# EAGLE design cyclops_r2b (EAGLE 6.4)

## Sheet 1 of 3
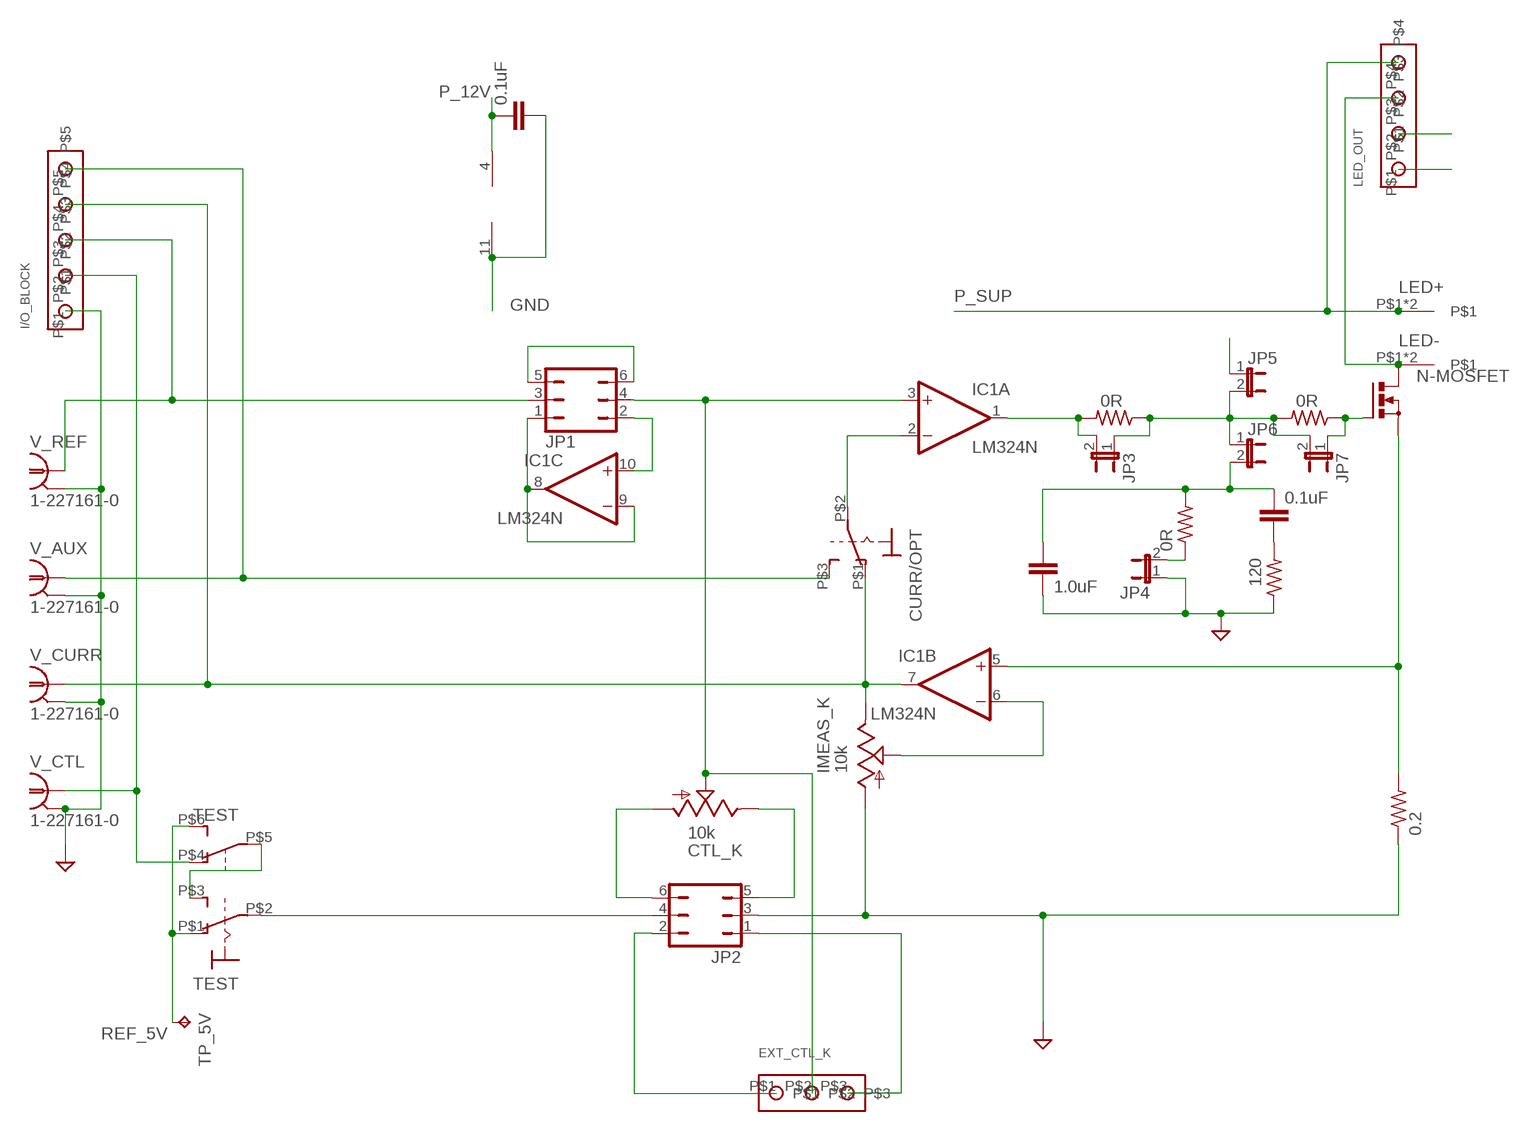
[diagram p0: schematic, sheet 1]

### Parts
C1  0.1uF  C-EU050-024X044  [C050-024X044]
C2  1.0uF  C-EU025-024X044  [C025-024X044]
C3  0.1uF  C-EU050-024X044  [C050-024X044]
CTL_K  10k  TRIM_US-RJ6S  [RJ6S]
CURR/OPT  SPST_SWITCH  [A_TOGGLE_SPST]
EXT_CTL_K  SCREW3  [SCREW3]
I/O_BLOCK  SCREW5  [SCREW5]
IC1  LM324N  [DIL14]
IMEAS_K  10k  TRIM_US-RJ6S  [RJ6S]
JP1  JP3Q  [JP3Q]
JP2  JP3Q  [JP3Q]
JP3  JP1E  [JP1]
JP4  JP1E  [JP1]
JP5  JP1E  [JP1]
JP6  JP1E  [JP1]
JP7  JP1E  [JP1]
LED+  BANANA_TO_BOARD  [BANANA_TO_BOARD]
LED-  BANANA_TO_BOARD  [BANANA_TO_BOARD]
LED_OUT  SCREW4  [SCREW4]
N-MOSFET  PMOSFET_NTO220BH  [TO220BH]
R1  0R  R-US_0207/7  [0207/7]
R2  0R  R-US_0207/7  [0207/7]
R3  120  R-US_0207/7  [0207/7]
R4  0R  R-US_0207/7  [0207/7]
R_CURR  0.2  R-US_  [IMEAS_R]
TEST  SP3T_SWITCH  [320-938]
TP_5V  TPPAD1-13  [P1-13]
V_AUX  1-227161-0  [AMP_227161]
V_CTL  1-227161-0  [AMP_227161]
V_CURR  1-227161-0  [AMP_227161]
V_REF  1-227161-0  [AMP_227161]

### Nets
GND: C1.2 C2.2 I/O_BLOCK.P$1 IC1.11(P:V-) IMEAS_K.A JP2.3 JP4.1 LED_OUT.P$1 R3.1 R_CURR.1 V_AUX.2(GND) V_CTL.2(GND) V_CURR.2(GND) V_REF.2(GND) ; also sheet 2,3
N$1: CURR/OPT.P$2(P) IC1.2(A:-IN)
N$2: IC1.5(B:+IN) N-MOSFET.S R_CURR.2
N$3: IC1.1(A:OUT) JP3.2 R1.2
N$4: CURR/OPT.P$1(O) I/O_BLOCK.P$4 IC1.7(B:OUT) IMEAS_K.E V_CURR.1
N$5: CURR/OPT.P$3(S) I/O_BLOCK.P$5 V_AUX.1
N$6: JP2.4 TEST.P$2(1:P)
N$7: CTL_K.E JP2.5
N$8: CTL_K.S EXT_CTL_K.P$2 IC1.3(A:+IN) JP1.4
N$9: IC1.8(C:OUT) IC1.9(C:-IN) JP1.1
N$10: I/O_BLOCK.P$2 TEST.P$4(B:O) V_CTL.1
N$11: C2.1 C3.1 JP6.2 R2.2
N$12: CTL_K.A JP2.6
N$13: C3.2 R3.2
N$14: IC1.10(C:+IN) JP1.2
N$15: IC1.6(B:-IN) IMEAS_K.S
N$17: JP1.5 JP1.6
N$18: I/O_BLOCK.P$3 JP1.3 V_REF.1
N$21: LED-.P$1 LED-.P$2 LED_OUT.P$3 N-MOSFET.D
N$23: TEST.P$3(1:S) TEST.P$5(B:P)
N$25: EXT_CTL_K.P$1 JP2.2
N$26: EXT_CTL_K.P$3 JP2.1
N$27: JP4.2 R2.1
N$29: JP3.1 JP5.2 JP6.1 JP7.2 R1.1 R4.2
N$30: JP7.1 N-MOSFET.G R4.1
N$69: JP5.1
P_12V: C1.1 IC1.4(P:V+) LED_OUT.P$2 ; also sheet 2
P_SUP: LED+.P$1 LED+.P$2 LED_OUT.P$4 ; also sheet 2,3
REF_5V: TEST.P$1(1:O) TEST.P$6(B:S) TP_5V.TP ; also sheet 2
Unconnected: IC1.12(D:+IN) IC1.13(D:-IN) IC1.14(D:OUT)

## Sheet 2 of 3
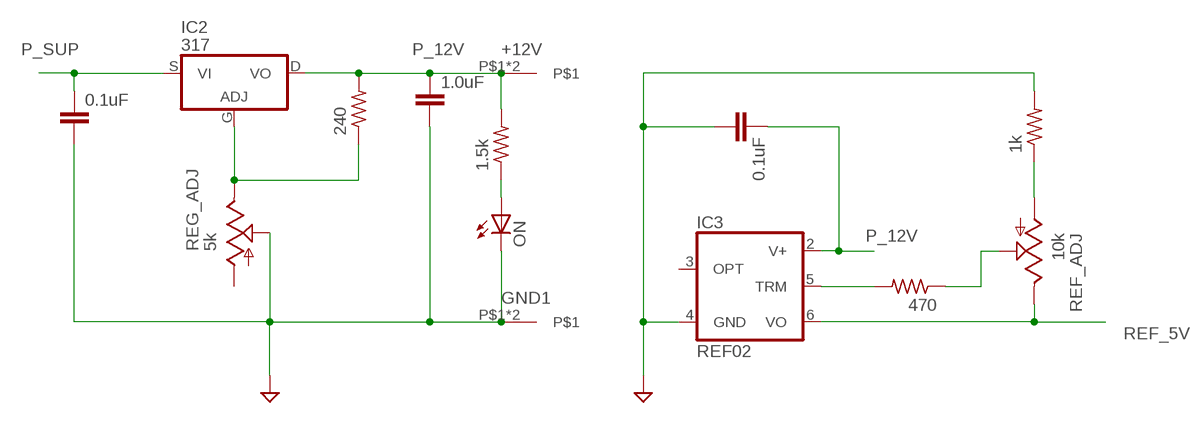
[diagram p1: schematic, sheet 2]

### Parts
+12V  BANANA_TO_BOARD  [BANANA_TO_BOARD]
C4  0.1uF  C-EU050-024X044  [C050-024X044]
C5  1.0uF  C-EU025-024X044  [C025-024X044]
C6  0.1uF  C-EU050-024X044  [C050-024X044]
GND1  BANANA_TO_BOARD  [BANANA_TO_BOARD]
IC2  317  [TO220BH]
IC3  REF02  REF02DIL08-LONG  [DIL08-OVAL]
ON  LED3MM  [LED3MM]
R5  240  R-US_0207/7  [0207/7]
R6  1.5k  R-US_0207/7  [0207/7]
R7  470  R-US_0207/7  [0207/7]
R8  1k  R-US_0207/7  [0207/7]
REF_ADJ  10k  TRIM_US-RJ6S  [RJ6S]
REG_ADJ  5k  TRIM_US-RJ6S  [RJ6S]

### Nets
GND: C4.2 C5.2 C6.2 GND1.P$1 GND1.P$2 IC3.4(GND) ON.K(C) R8.2 REG_ADJ.S ; also sheet 1,3
N$19: IC2.G(ADJ) R5.1 REG_ADJ.E
N$20: IC3.5(TRM) R7.2
N$22: R7.1 REF_ADJ.S
N$24: R8.1 REF_ADJ.A
N$28: ON.A R6.1
P_12V: +12V.P$1 +12V.P$2 C5.1 C6.1 IC2.D(VO) IC3.2(V+) R5.2 R6.2 ; also sheet 1
P_SUP: C4.1 IC2.S(VI) ; also sheet 1,3
REF_5V: IC3.6(VO) REF_ADJ.E ; also sheet 1
Unconnected: IC3.3(OPT) REG_ADJ.A

## Sheet 3 of 3
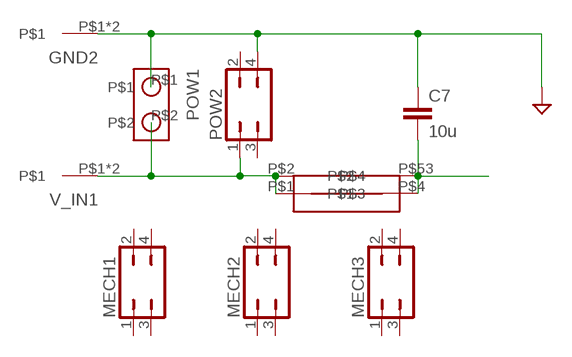
[diagram p2: schematic, sheet 3]

### Parts
C7  10u  C-EU025-024X044  [C025-024X044]
GND2  BANANA_TO_BOARD  [BANANA_TO_BOARD]
MECH1  JP2Q  [JP2Q]
MECH2  JP2Q  [JP2Q]
MECH3  JP2Q  [JP2Q]
POW1  SCREW2  [SCREW2]
POW2  JP2Q  [JP2Q]
U$1  FUSE >2A  NXT-FUSE  [NXT-FUSE]
V_IN1  BANANA_TO_BOARD  [BANANA_TO_BOARD]

### Nets
GND: C7.1 GND2.P$1 GND2.P$2 POW1.P$1 POW2.4 ; also sheet 1,2
P_SUP: C7.2 U$1.P$4 U$1.P$53 ; also sheet 1,2
P_SUP_BEFORE: POW1.P$2 POW2.1 U$1.P$1 U$1.P$2 V_IN1.P$1 V_IN1.P$2
Unconnected: MECH1.1 MECH1.2 MECH1.3 MECH1.4 MECH2.1 MECH2.2 MECH2.3 MECH2.4 MECH3.1 MECH3.2 MECH3.3 MECH3.4 POW2.2 POW2.3

## Library data of the parts
+12V GND1 GND2 LED+ LED- V_IN1 = cyclops:BANANA_TO_BOARD: Female banana socket to board, right angle. Digikey part: J111-ND (or similar).
C1-C7 = rcl:C-EU: CAPACITOR, European symbol
CTL_K IMEAS_K REF_ADJ REG_ADJ = HOSS:TRIM_US-: POTENTIOMETER
CURR/OPT = HOSS:SPST_SWITCH: TOGGLE SWITCH distributor RS Components
EXT_CTL_K = HOSS:SCREW3
I/O_BLOCK = HOSS:SCREW5
IC1 = linear:LM324: OP AMP
IC2 = HOSS:*317: Positive VOLTAGE REGULATOR
IC3 = linear:REF02: VOLTAGE REFERENCE
JP1 JP2 = jumper:JP3Q: JUMPER
JP3-JP7 = jumper:JP1E: JUMPER
LED_OUT = HOSS:SCREW4
MECH1-MECH3 POW2 = jumper:JP2Q: JUMPER
N-MOSFET = transistor-power:PMOSFET_N: Power MOSFET N-Channel
ON = led:LED: LED OSRAM: - CHIPLED LG R971, LG N971, LY N971, LG Q971, LY Q971, LO R971, LY R971 LH N974, LH R974 LS Q976, LO Q976, LY Q976 LO Q996 - Hyper CHIPLED LW Q18S LB Q993, LB Q99A, LB R99A - SideLED LS A670, LO A670, LY A670, LG A670, LP A670 LB A673, LV A673, LT A673, LW A673 LH A674 LY A675 LS A676, LA A676, LO A676, LY A676, LW A676 LS A679, LY A679, LG A679 - Hyper Micro SIDELED® LS Y876, LA Y876, LO Y876, LY Y876 LT Y87S - SmartLED LW L88C, LW L88S LB L89C, LB L89S, LG L890 LS L89K, LO L89K, LY L89K LS L896, LA L896, LO L896, LY L896 - TOPLED LS T670, LO T670, LY T670, LG T670, LP T670 LSG T670, LSP T670, LSY T670, LOP T670, LYG T670 LG T671, LOG T671, LSG T671 LB T673, LV T673, LT T673, LW T673 LH T674 LS T676, LA T676, LO T676, LY T676, LB T676, LH T676, LSB T676, LW T676 LB T67C, LV T67C, LT T67C, LS T67K, LO T67K, LY T67K, LW E67C LS E67B, LA E67B, LO E67B, LY E67B, LB E67C, LV E67C, LT E67C LW T67C LS T679, LY T679, LG T679 LS T770, LO T770, LY T770, LG T770, LP T770 LB T773, LV T773, LT T773, LW T773 LH T774 LS E675, LA E675, LY E675, LS T675 LS T776, LA T776, LO T776, LY T776, LB T776 LHGB T686 LT T68C, LB T68C - Hyper Mini TOPLED® LB M676 - Mini TOPLED Santana® LG M470 LS M47K, LO M47K, LY M47K Source: http://www.osram.convergy.de LUXEON: - LUMILED® LXK2-PW12-R00, LXK2-PW12-S00, LXK2-PW14-U00, LXK2-PW14-V00 LXK2-PM12-R00, LXK2-PM12-S00, LXK2-PM14-U00 LXK2-PE12-Q00, LXK2-PE12-R00, LXK2-PE12-S00, LXK2-PE14-T00, LXK2-PE14-U00 LXK2-PB12-K00, LXK2-PB12-L00, LXK2-PB12-M00, LXK2-PB14-N00, LXK2-PB14-P00, LXK2-PB14-Q00 LXK2-PR12-L00, LXK2-PR12-M00, LXK2-PR14-Q00, LXK2-PR14-R00 LXK2-PD12-Q00, LXK2-PD12-R00, LXK2-PD12-S00 LXK2-PH12-R00, LXK2-PH12-S00 LXK2-PL12-P00, LXK2-PL12-Q00, LXK2-PL12-R00 Source: www.luxeon.com KINGBRIGHT: KA-3528ASYC Source: www.kingbright.com
POW1 = HOSS:SCREW2
R1-R8 R_CURR = HOSS:R-US_: RESISTOR, American symbol
TEST = HOSS:SP3T_SWITCH: TOGGLE SWITCH distributor RS Components
TP_5V = testpad:TP: Test pad
U$1 = HOSS:NXT-FUSE
V_AUX V_CTL V_CURR V_REF = cyclops:?227161*: JACK, RIGHT ANGLE, 50 OHM, PCB, BNC Source: amp_227161.pdf

## Board
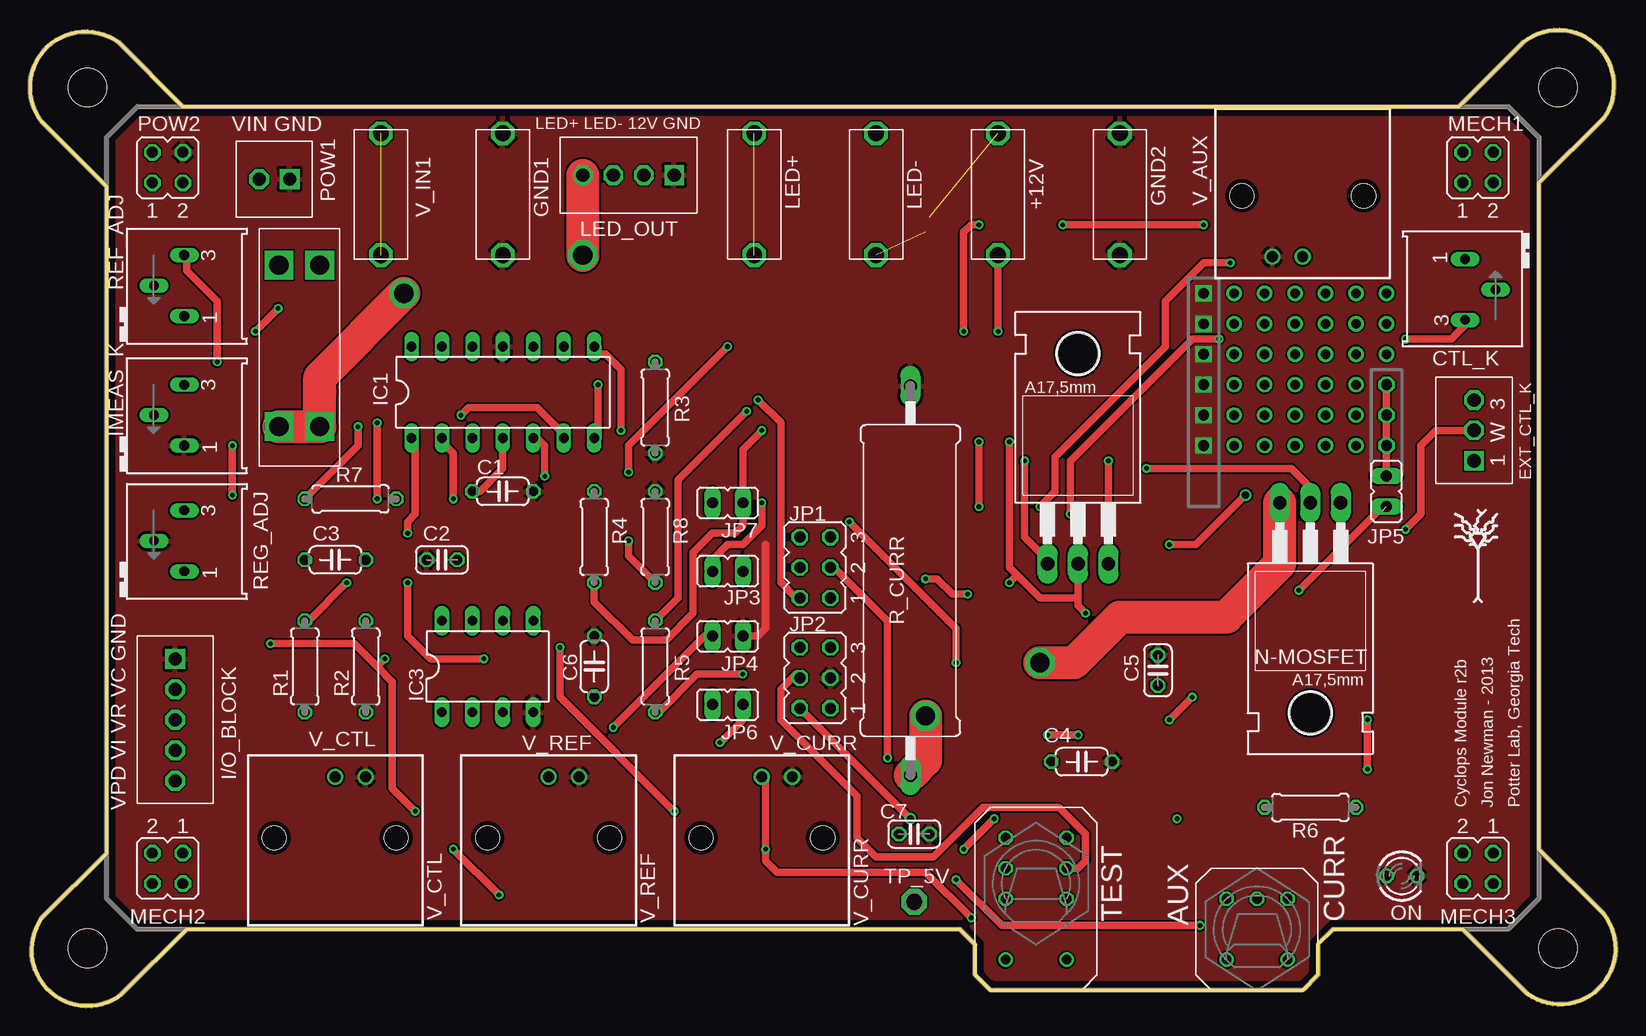
[diagram p3: board, top side]
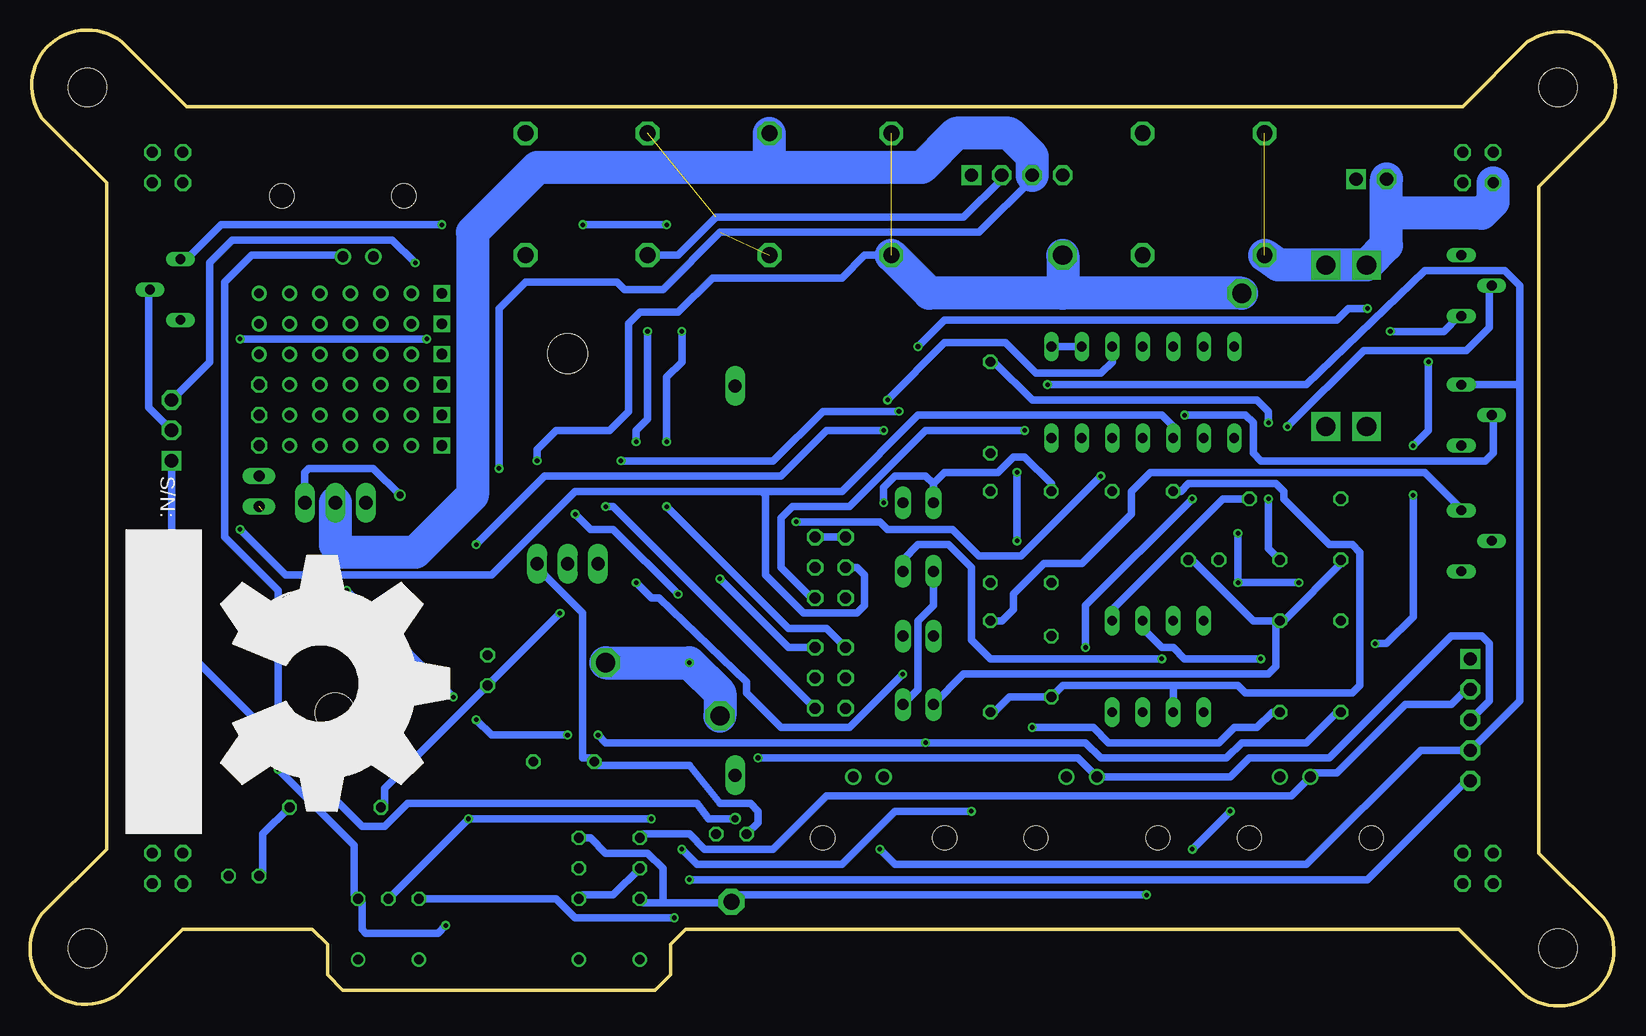
[diagram p4: board, bottom side, seen from below]

Size 132.17 x 81.37 mm. Coordinates in mm from the lower left corner, seen from the top.
Outline: 6.4,12.75 6.4,68.31 1,73.71 arc-164 7.35,80.37 12.75,74.98 119.11,74.98 124.51,80.37 arc-164 131.17,74.02 125.78,68.63 125.78,13.06 131.17,7.67 arc-164 124.82,1 119.43,6.4 108.63,6.4 107.36,5.13 107.36,2.59 106.09,1.32 80.06,1.32 78.79,2.59 78.79,5.13 77.52,6.4 13.06,6.4 7.67,1 arc-164 1,7.35 6.4,12.75
Copper layers (1*16): Top 0.0356mm / dielectric 1.5011mm / Bottom 0.0356mm
Design rules "ohs-park-mod *": minimum track width 6mil, minimum drill 13mil, track to track 6mil, track to pad 6mil, pad to pad 6mil, via to via 6mil, smd to smd 6mil, copper to edge 15mil, drill to drill 6mil, minimum pad ring 7mil, minimum via ring 7mil, stop-mask expansion 4mil, vias tented up to drill 15mil, thermal gap 10mil
Holes 3.2 mm at 127.36,76.56 4.81,4.81 127.36,4.81 4.81,76.56
tKeepout: area 77.8,41 to 96.9,58.8; area 97.2,20 to 116.3,37.8

### Footprints (pad centres in the part's own frame; a part is rotated, then mirrored left to right if it is on the bottom)
BANANA_TO_BOARD = drill 1.321 octagon: P$1 0,0; P$2 10.16,0
C050-024X044 = drill 0.813 octagon: 1 -2.54,0; 2 2.54,0
C025-024X044 = drill 0.813 octagon: 1 -1.27,0; 2 1.27,0
RJ6S = drill 0.813 long: A 2.54,-0.2; E -2.54,-0.2; S 0,-2.74
A_TOGGLE_SPST = drill 0.8 octagon: P$1 -2.54,6.35; P$2 0,6.35; P$3 2.54,6.35 | drill 0.8: P$14 2.54,1.27; P$15 -2.54,1.27
SCREW3 = drill 1.1 square: P$1 0,0 | drill 1.1 octagon: P$2 2.54,0; P$3 5.08,0
SCREW5 = drill 1.1 square: P$1 0,0 | drill 1.1 octagon: P$2 2.54,0; P$3 5.08,0; P$4 7.62,0; P$5 10.16,0
DIL14 = drill 0.813 long: 1 -7.62,-3.81; 2 -5.08,-3.81; 3 -2.54,-3.81; 4 0,-3.81; 5 2.54,-3.81; 6 5.08,-3.81; 7 7.62,-3.81; 8 7.62,3.81; 9 5.08,3.81; 10 2.54,3.81; 11 0,3.81; 12 -2.54,3.81; 13 -5.08,3.81; 14 -7.62,3.81
TO220BH = drill 1.118 long: D 0,-6.35; G -2.54,-6.35; S 2.54,-6.35 | hole 3.302: 0,11.176
DIL08-OVAL = drill 0.813 pad 1.27 long: 1 -3.81,-3.81; 2 -1.27,-3.81; 3 1.27,-3.81; 4 3.81,-3.81; 5 3.81,3.81; 6 1.27,3.81; 7 -1.27,3.81; 8 -3.81,3.81
JP3Q = drill 0.914 octagon: 1 -2.54,-1.27; 2 -2.54,1.27; 3 0,-1.27; 4 0,1.27; 5 2.54,-1.27; 6 2.54,1.27
JP1 = drill 0.914 long: 1 0,-1.27; 2 0,1.27
SCREW4 = drill 1.1 square: P$1 0,0 | drill 1.1 octagon: P$2 2.54,0; P$3 5.08,0; P$4 7.62,0
JP2Q = drill 0.914 octagon: 1 -1.27,-1.27; 2 1.27,-1.27; 3 -1.27,1.27; 4 1.27,1.27
LED3MM = drill 0.813 octagon: A -1.27,0; K 1.27,0
SCREW2 = drill 1.1 square: P$1 0,0 | drill 1.1 octagon: P$2 2.54,0
0207/7 = drill 0.813 octagon: 1 -3.81,0; 2 3.81,0
IMEAS_R = drill 1.1 long: 1 -3.23,0; 2 29.23,0
320-938 = drill 0.8 octagon: P$1 2.54,3.81; P$2 2.54,1.27; P$3 2.54,-1.27; P$4 -2.54,3.81; P$5 -2.54,1.27; P$6 -2.54,-1.27 | drill 0.8: P$14 2.54,-6.35; P$15 -2.54,-6.35
P1-13 = drill 1.321 pad 2.159 octagon: TP 0,0
NXT-FUSE = drill 1.6 square: P$1 3.048,1.651; P$2 3.048,5.055; P$4 16.51,5.055; P$53 16.51,1.651
AMP_227161 = drill 0.9 pad 1.27: 1 0,-5.08; 2 -2.54,-5.08 | hole 2: -5.08,0; 5.08,0

### Placement (x,y rotation side)
+12V  80.69,62.59 90 top
C1  39.42,42.91 0 top
C2  34.34,37.19 180 top
C3  25.45,37.19 0 top
C4  87.68,20.37 0 top
C5  94.03,27.99 90 top
C6  47.04,28.3 90 top
C7  10uF  [C025-024X044]  73.71,14.33 180 top
CTL_K  119.43,59.74 90 top
CURR/OPT  102.28,2.59 0 top
EXT_CTL_K  120.38,45.45 90 top
GND1  39.42,72.75 270 top
GND2  90.85,62.59 90 top
I/O_BLOCK  12.11,28.94 270 top
IC1  39.42,51.16 0 top
IC2  87.36,43.23 0 top
IC3  38.15,28.3 0 top
IMEAS_K  13.06,49.26 270 top
JP1  65.45,36.56 90 top
JP2  65.45,27.35 90 top
JP3  58.15,36.24 270 top
JP4  58.15,30.84 90 top
JP5  113.08,42.91 180 top
JP6  58.15,25.13 90 top
JP7  58.15,41.96 90 top
LED+  60.37,62.59 90 top
LED-  70.53,72.75 270 top
LED_OUT  53.7,69.26 180 top
MECH1  120.7,69.9 0 top
MECH2  11.48,11.48 180 top
MECH3  120.7,11.48 180 top
N-MOSFET  106.73,35.61 180 top
ON  114.35,10.84 0 top
POW1  21.64,68.94 180 top
POW2  11.48,69.9 0 top
R1  22.91,28.3 90 top
R2  27.99,28.3 90 top
R3  52.12,49.89 90 top
R4  47.04,39.1 90 top
R5  52.12,28.3 270 top
R6  106.73,16.56 180 top
R7  26.72,42.27 0 top
R8  52.12,39.1 90 top
R_CURR  73.39,48.46 270 top
REF_ADJ  13.06,60.05 270 top
REG_ADJ  13.06,38.78 270 top
TEST  83.87,10.21 0 top
TP_5V  [P1-13]  73.71,8.68 0 top
U$1  19.1,64.82 270 top
U$2  [OSHW_FILLX750_NOTEXT]  116.25,37.51 270 bottom
V_AUX  106.09,67.55 0 top
V_CTL  25.45,14.02 180 top
V_CURR  61.01,14.02 180 top
V_IN1  29.26,62.59 90 top
V_REF  43.23,14.02 180 top

### Tracks (layer width: path | path; a pad name or v marks a point on that pad's centre or on a via)
GND  (via drill 0.9)
  Top 0.61: 61.32,38.46 61.32,31.48 60.69,30.84 JP4.1
  other vias: 97.84,46.72 97.84,49.26 97.84,51.8 97.84,54.34 97.84,56.88 97.84,59.42
  pour Top: 7.35,72.12 9.25,74.02 122.92,74.02 124.82,72.12 124.82,9.25 122.92,7.35 108.31,7.35 106.41,5.44 106.41,2.9 105.77,2.27 80.37,2.27 79.74,2.9 79.74,5.44 77.83,7.35 9.25,7.35 7.35,9.25
N$1  (via drill 0.38)
  Top 0.61: v77.83,13.06 v80.37,15.6 | v53.7,16.24 44.18,25.76 v44.18,29.89 | v35.29,42.27 35.29,46.08 34.65,46.72 34.65,47.35 IC1.2
  Bottom 0.61: v80.37,15.6 v95.61,15.6 CURR/OPT.P$2 | v77.83,13.06 76.56,11.79 64.5,11.79 60.05,16.24 v53.7,16.24 | v44.18,29.89 44.18,33.38 v35.29,42.27
N$2  (via drill 0.38, 1.6)
  Top 0.61: v42.91,44.18 42.91,46.72 42.27,47.35 IC1.5 | v68.31,40.37 77.2,31.48 v77.2,28.62
  Top 2.769: N-MOSFET.S 104.19,36.88 99.74,32.43 90.85,32.43 87.04,28.62 v84.18,28.62 | R_CURR.2 74.66,20.5 v74.66,24.18
  Bottom 0.61: v68.31,40.37 61.32,40.37 60.69,39.73 55.29,39.73 53.07,37.51 49.58,37.51 v42.91,44.18
  Bottom 2.769: v84.18,28.62 v77.2,28.62 74.66,26.08 v74.66,24.18
N$3  (via drill 0.38)
  Top 0.61: v26.4,35.29 23.22,32.11 R1.2 | IC1.1 32.11,47.35 32.11,41 31.48,40.37 v31.48,39.42 | v37.83,28.94 33.38,28.94 31.48,30.84 v31.48,35.29
  Bottom 0.61: JP3.2 59.42,37.19 58.15,38.46 55.61,38.46 53.7,36.56 53.7,30.53 52.12,28.94 v37.83,28.94 | v26.4,35.29 v31.48,35.29 v31.48,39.42
N$4  (via drill 0.38)
  Top 0.61: v78.47,7.35 74.66,11.16 62.28,11.16 61.32,12.11 v61.32,13.06 61.32,18.78 V_CURR.1 | v47.35,51.8 47.35,47.35 IC1.7
  Bottom 0.61: v47.35,51.8 25.76,51.8 15.92,61.32 9.25,61.32 7.98,60.05 7.98,51.8 | v61.32,13.06 60.05,11.79 25.76,11.79 16.24,21.32 I/O_BLOCK.P$4 7.98,25.45 7.98,51.8 | 7.98,51.8 IMEAS_K.E | v78.47,7.35 86.72,7.35 88.31,8.94 CURR/OPT.P$1
N$5  (via drill 0.38)
  Top 0.61: v111.49,19.73 v111.49,23.86 | v77.2,10.52 81.01,6.71 v97.52,6.71
  Bottom 0.61: v77.2,10.52 20.68,10.52 12.43,18.78 I/O_BLOCK.P$5 | V_AUX.1 106.22,62.59 113.71,62.59 115.93,60.37 115.93,39.1 111.49,34.65 v111.49,23.86 | v97.52,6.71 98.15,6.08 104.19,6.08 104.5,6.4 104.5,8.62 CURR/OPT.P$3 105.14,9.25 105.14,13.38 v111.49,19.73
N$6
  Top 0.61: JP2.4 63.86,27.67 62.59,26.4 62.59,23.86 68.94,17.51 68.94,14.02 70.53,12.43 75.29,12.43 79.42,16.56 85.77,16.56 87.99,14.33 87.99,12.11 87.36,11.48 TEST.P$2
N$7  (via drill 0.38)
  Top 0.61: v86.72,41 86.72,45.45 96.88,55.61 v99.11,55.61 | CTL_K.E 119.63,56.76 118.47,55.61 v114.66,55.61 | v78.15,34.34 76.88,34.34 75.61,35.61 v74.66,35.61
  Bottom 0.61: v86.72,41 85.45,39.73 83.55,39.73 v78.15,34.34 | v114.66,55.61 v99.11,55.61 | v74.66,35.61 68.94,29.89 JP2.5
N$8  (via drill 0.38)
  Top 0.61: v114.66,39.73 115.93,41 115.93,46.72 117.2,47.99 EXT_CTL_K.P$2
  Bottom 0.61: CTL_K.S 122.28,59.42 122.28,49.89 EXT_CTL_K.P$2 | v114.66,39.73 110.85,35.92 93.71,35.92 86.72,42.91 71.17,42.91 | 71.17,42.91 64.5,42.91 58.15,49.26 37.83,49.26 36.88,48.31 IC1.3 | 71.17,42.91 70.85,42.59 70.85,35.92 67.67,32.75 63.23,32.75 62.59,33.38 62.59,35.92 63.23,36.56 JP1.4
N$9  (via drill 0.38)
  Top 0.61: v49.26,47.99 49.26,53.07 47.99,54.34 47.35,54.34 47.35,54.97 IC1.8
  Bottom 0.61: IC1.9 IC1.8 | v49.26,47.99 57.51,47.99 63.86,41.64 68.63,41.64 69.58,40.69 69.58,36.56 67.04,34.02 JP1.1
N$10
  Bottom 0.61: TEST.P$4 81.01,14.33 77.2,14.33 75.93,13.06 70.21,13.06 65.77,17.51 27.03,17.51 V_CTL.1 25.13,19.41 23.22,19.41 17.51,25.13 13.7,25.13 12.43,26.4 I/O_BLOCK.P$2
N$11
  Bottom 0.61: C3.1 22.59,37.19 27.67,32.11 R2.2 28.3,32.11 | 28.3,32.11 30.21,32.11 35.29,37.19 C2.1 | JP6.2 54.34,27.67 28.94,27.67 28.3,28.3 28.3,32.11
N$12  (via drill 0.38)
  Top 0.61: v79.1,41.64 v79.1,47.04 | v86.09,65.13 v97.84,65.13 | v77.83,56.24 77.83,64.5 78.47,65.13 v79.1,65.13
  Bottom 0.61: v97.84,65.13 116.25,65.13 119.11,62.28 CTL_K.A | v79.1,41.64 68.94,31.48 65.77,31.48 JP2.6 | v79.1,65.13 v86.09,65.13 | v79.1,47.04 79.1,52.43 77.83,53.7 v77.83,56.24
N$13  (via drill 0.38)
  Top 0.61: v28.94,42.27 v28.94,48.62
  Bottom 0.61: R3.2 51.8,53.7 48.62,50.53 29.89,50.53 28.94,49.58 v28.94,48.62 | C3.2 28.94,38.15 v28.94,42.27
N$14  (via drill 0.38)
  Top 0.61: v60.69,50.53 62.59,48.62 62.59,35.29 63.86,34.02 JP1.2
  Bottom 0.61: v60.69,50.53 55.93,55.29 50.85,55.29 48.31,52.75 42.91,52.75 41.96,53.7 IC1.10
N$15  (via drill 0.38)
  Top 0.61: v35.92,49.26 36.56,49.89 42.27,49.89 44.18,47.99 44.18,47.35 IC1.6
  Bottom 0.61: 10.52,49.26 IMEAS_K.S 10.21,49.14 10.21,46.08 10.84,45.45 29.57,45.45 30.21,46.08 30.21,48.62 30.84,49.26 v35.92,49.26
N$17
  Bottom 0.61: JP1.6 JP1.5
N$18  (via drill 0.38)
  Top 0.61: v71.48,20.68 71.48,32.11 67.04,36.56 JP1.3
  Bottom 0.61: I/O_BLOCK.P$3 10.52,25.45 10.52,30.21 11.16,30.84 13.7,30.84 23.86,20.68 30.53,20.68 32.11,19.1 V_REF.1 44.81,20.68 v71.48,20.68
N$19  (via drill 0.38)
  Top 0.61: v82.91,45.45 82.91,39.1 84.82,37.19 IC2.G | v59.74,49.58 54.02,43.86 54.02,34.02 R5.1
  Bottom 0.61: REG_ADJ.E 13.06,41.64 15.92,44.5 38.78,44.5 40.37,42.91 40.37,41 44.5,36.88 47.67,36.88 50.21,34.34 50.21,33.07 51.16,32.11 R5.1 | v59.74,49.58 66.09,49.58 70.21,45.45 v82.91,45.45
N$20
  Bottom 0.61: 41.64,32.11 IC3.5 41.96,33.07 32.75,42.27 R7.2
N$21  (via drill 0.38)  (1 unrouted)
  Top 0.61: v93.07,44.81 105.14,44.81 106.41,43.54 106.41,42.27 N-MOSFET.D
  Bottom 0.61: 48.62,68.94 53.07,64.5 74.66,64.5 79.42,59.74 82.6,59.74 83.23,60.37 90.85,60.37 93.07,58.15 v93.07,44.81
  Bottom 2.769: N-MOSFET.D 106.73,38.46 106.09,37.83 100.06,37.83 95.3,42.59 95.3,64.5 89.9,69.9 70.53,69.9 | LED_OUT.P$3 48.62,70.85 50.53,72.75 54.97,72.75 57.83,69.9 70.53,69.9 | 70.53,69.9 LED-.P$1
N$22  (via drill 0.38)
  Top 0.61: R7.1 27.35,46.72 v27.35,48.31
  Bottom 0.61: v27.35,48.31 21,54.66 12.43,54.66 10.52,56.56 10.52,59.85 REF_ADJ.S 10.52,60.05
N$23
  Bottom 0.61: TEST.P$5 83.55,9.25 86.09,9.25 TEST.P$3
N$24  (via drill 0.38)
  Top 0.61: v18.78,56.24 v20.68,58.15 | v58.15,54.97 49.89,46.72 v49.89,44.5 | v49.89,38.78 49.89,37.51 R8.1
  Bottom 0.61: v18.78,56.24 14.33,56.24 13.06,57.51 REF_ADJ.A | v20.68,58.15 22.27,58.15 23.22,57.2 55.93,57.2 v58.15,54.97 | v49.89,44.5 v49.89,38.78
N$25  (via drill 0.6)
  Top 0.61: v73.39,15.6 JP2.2
  Bottom 0.61: EXT_CTL_K.P$1 120.38,30.84 104.5,14.97 102.6,14.97 100.69,16.87 76.56,16.87 75.61,15.6 v73.39,15.6
N$26  (via drill 0.38)
  Top 0.61: v84.18,41.64 85.45,42.91 85.45,45.77 94.66,54.97 94.66,58.78 97.84,61.96 v100.06,61.96
  Bottom 0.61: v84.18,41.64 83.55,41.64 JP2.1 | v100.06,61.96 101.96,63.86 115.3,63.86 117.2,61.96 117.2,53.7 EXT_CTL_K.P$3
N$27  (via drill 0.38)
  Top 0.61: v48.62,23.22 56.24,30.84 JP4.2
  Bottom 0.61: R2.1 28.62,24.49 29.89,23.22 31.8,23.22 33.07,21.95 42.27,21.95 43.54,23.22 v48.62,23.22
N$28
  Bottom 0.61: ON.A 112.76,11.16 112.76,14.33 R6.1 110.85,16.24
N$29  (via drill 0.38)  (1 unrouted)
  Top 0.61: v57.51,21.95 59.42,23.86 JP6.1 | 112.76,41.32 112.44,41.32 v105.77,34.65 | v84.82,22.59 v87.36,22.59 | v94.98,23.86 v96.88,25.76 | JP3.1 56.88,37.19 58.15,38.46 59.42,38.46 61.01,40.05 v61.01,41.96
  Bottom 0.61: v84.82,22.59 84.18,21.95 v57.51,21.95 44.18,21.95 42.91,20.68 32.43,20.68 31.16,21.95 25.76,21.95 23.22,24.49 R1.1 | JP3.1 56.88,33.38 58.15,32.11 58.15,26.4 JP6.1 | v87.36,22.59 93.71,22.59 v94.98,23.86 | v96.88,25.76 v105.77,34.65 | 47.04,43.23 R4.2 47.04,43.54 49.26,45.77 50.21,45.77 51.48,44.5 55.93,44.5 56.88,43.54 | 56.88,43.54 JP7.2 | v61.01,41.96 61.01,43.23 60.05,44.18 57.51,44.18 56.88,43.54
N$30  (via drill 0.38, 0.6)
  Top 0.61: R4.1 47.04,33.7 50.21,30.53 53.07,30.53 55.29,32.75 55.29,37.83 56.88,39.42 58.78,39.42 59.42,40.05 JP7.1 59.42,46.4 v61.01,47.99 | v94.98,38.46 97.2,38.46 v101.33,42.59
  Bottom 0.61: v94.98,38.46 89.26,44.18 69.58,44.18 65.77,47.99 v61.01,47.99 | v101.33,42.59 103.55,44.81 108.95,44.81 109.27,44.5 N-MOSFET.G
N$32  (via drill 0.8 pad 1.27)
  other vias: 100.38,56.88
N$33  (via drill 0.8 pad 1.27)
  other vias: 113.08,54.34
N$34  (via drill 0.8 pad 1.27)
  other vias: 113.08,56.88
N$35  (via drill 0.8 pad 1.27)
  other vias: 110.54,56.88
N$36  (via drill 0.8 pad 1.27)
  other vias: 108,56.88
N$37  (via drill 0.8 pad 1.27)
  other vias: 105.46,56.88
N$38  (via drill 0.8 pad 1.27)
  other vias: 102.92,56.88
N$39  (via drill 0.8 pad 1.27)
  other vias: 105.46,46.72
N$40  (via drill 0.8 pad 1.27)
  other vias: 100.38,59.42
N$41  (via drill 0.8 pad 1.27)
  other vias: 102.92,59.42
N$42  (via drill 0.8 pad 1.27)
  other vias: 100.38,54.34
N$43  (via drill 0.8 pad 1.27)
  other vias: 102.92,54.34
N$44  (via drill 0.8 pad 1.27)
  other vias: 105.46,54.34
N$45  (via drill 0.8 pad 1.27)
  other vias: 108,54.34
N$46  (via drill 0.8 pad 1.27)
  other vias: 110.54,54.34
N$47  (via drill 0.8 pad 1.27)
  other vias: 110.54,51.8
N$48  (via drill 0.8 pad 1.27)
  other vias: 108,51.8
N$49  (via drill 0.8 pad 1.27)
  other vias: 105.46,51.8
N$50  (via drill 0.8 pad 1.27)
  other vias: 102.92,51.8
N$51  (via drill 0.8 pad 1.27)
  other vias: 100.38,51.8
N$52  (via drill 0.8 pad 1.27)
  other vias: 105.46,59.42
N$53  (via drill 0.8 pad 1.27)
  other vias: 108,59.42
N$54  (via drill 0.8 pad 1.27)
  other vias: 100.38,49.26
N$55  (via drill 0.8 pad 1.27)
  other vias: 102.92,49.26
N$56  (via drill 0.8 pad 1.27)
  other vias: 105.46,49.26
N$57  (via drill 0.8 pad 1.27)
  other vias: 108,49.26
N$58  (via drill 0.8 pad 1.27)
  other vias: 110.54,49.26
N$59  (via drill 0.8 pad 1.27)
  other vias: 110.54,46.72
N$60  (via drill 0.8 pad 1.27)
  other vias: 108,46.72
N$62  (via drill 0.8 pad 1.27)
  other vias: 102.92,46.72
N$63  (via drill 0.8 pad 1.27)
  other vias: 100.38,46.72
N$64  (via drill 0.8 pad 1.27)
  other vias: 110.54,59.42
N$65  (via drill 0.8 pad 1.27)
  other vias: 113.08,59.42
N$69  (via drill 0.9)
  Top 0.61: v113.08,51.8 v113.08,49.26 v113.08,46.72 JP5.1
P_12V  (via drill 0.38)  (1 unrouted)
  Top 0.61: v87.99,32.75 87.36,33.38 87.36,34.02 | IC2.D 87.36,34.02 | 82.28,35.92 84.18,34.02 87.36,34.02 | 82.28,35.92 81.64,36.56 v81.64,47.04 | v59.42,27.67 55.61,27.67 52.43,24.49 R5.2 | v80.69,56.24 +12V.P$1 | v81.64,35.29 82.28,35.92 | C1.1 37.51,42.91 39.42,44.81 IC1.4
  Bottom 0.61: LED_OUT.P$2 51.16,68.94 54.34,65.77 74.98,65.77 78.15,62.59 +12V.P$1 80.37,62.59 | R6.2 102.6,16.87 102.6,18.14 C5.1 v87.99,32.75 | R5.2 51.8,24.49 50.53,25.76 C6.1 46.08,26.72 36.88,26.72 | v59.42,27.67 63.86,23.22 69.58,23.22 72.44,26.08 72.44,27.03 79.74,34.02 80.37,34.02 v81.64,35.29 | 87.36,36.56 IC2.D | v80.69,56.24 80.69,48.94 81.64,47.99 v81.64,47.04 | 36.88,26.72 31.48,26.72 30.84,26.08 21.95,26.08 21.32,26.72 21.32,37.83 21.95,38.46 23.86,38.46 27.67,42.27 27.67,42.91 28.3,43.54 35.61,43.54 36.24,42.91 C1.1 | IC3.2 36.88,26.72
P_SUP  (via drill 0.38, 1.6)  (1 unrouted)
  Top 0.61: v89.9,45.45 IC2.S | 24.15,51.16 24.49,51.16 24.18,52.43
  Top 2.769: 24.18,52.43 v31.16,59.42 | 24.15,52.41 24.15,51.16 U$1.P$4 U$1.P$53 | LED_OUT.P$4 v46.08,62.59
  Bottom 0.61: IC2.S 89.9,36.56 86.09,32.75 86.09,20.68 85.45,20.68 C4.1 84.82,20.05 77.2,20.05 74.66,16.87 72.12,16.87 71.48,16.24 71.48,15.29 C7.2 | LED+.P$1 62.59,62.59 64.5,60.69 75.29,60.69 78.15,57.83 81.33,57.83 82.28,56.88 82.28,49.58 83.87,47.99 88.31,47.99 89.9,46.4 v89.9,45.45
  Bottom 2.769: LED+.P$1 57.2,59.42 46.08,59.42 | v31.16,59.42 46.08,59.42 | v46.08,62.59 46.08,59.42
P_SUP_BEFORE  (1 unrouted)
  Bottom 2.769: POW2.1 10.21,67.04 11.16,66.09 19.1,66.09 | V_IN1.P$1 28.11,61.77 U$1.P$2 U$1.P$1 19.1,63.42 19.1,66.09 | 19.1,66.09 POW1.P$2
REF_5V  (via drill 0.38)
  Top 0.61: REF_ADJ.E 13.06,62.59 13.06,61.32 15.6,58.78 v15.6,53.7 | 28.94,28.3 30.21,27.03 30.21,18.14 v32.11,16.24 | 28.94,28.3 27.03,30.21 v20.05,30.21 | 28.94,28.3 v29.57,28.94 | v39.1,9.25 v35.29,13.06 | v16.87,42.59 16.87,46.08 v16.87,46.72
  Bottom 0.61: 79.42,8.62 74.02,8.62 TP_5V.TP 73.39,9.25 v39.1,9.25 | 79.42,8.62 81.01,8.62 TEST.P$6 | v29.57,28.94 35.92,28.94 36.88,29.89 37.83,29.89 39.42,31.48 IC3.6 | v35.29,13.06 v32.11,16.24 | v16.87,42.59 16.87,32.43 19.1,30.21 v20.05,30.21 | TEST.P$1 85.45,14.02 84.18,12.75 80.69,12.75 79.42,11.48 79.42,8.62 | v15.6,53.7 15.6,47.99 v16.87,46.72

### Text on the board
tPlace: VIN GND | LED+ LED- 12V GND | 1 W 3 | VPD VI VR VC GND | V_CTL | V_REF | V_CURR | AUX | CURR
bPlace: S/N:
tNames: Cyclops Module r2b | Jon Newman - 2013 | Potter Lab, Georgia Tech
tDocu: V_GATE | GND | + | + | + | +